# Altium schematic sheet Quadcopter.SchDoc
size A; PageSetup: Record=PageOptions|CenterHorizontal=True|CenterVertical=True|PrintScale=1.00|XCorrection=1.00|YCorrection=1.00|PrintKind=1|BorderSize=5000000|LeftOffset=0|BottomOffset=0|Orientation=2|PaperLength=1000|PaperWidth=1000|Scale=100|PaperSource=7|PrintQuality=-3|MediaType=1|DitherType=10|PrintScaleMode=1|PaperKind=A3|PaperIndex=8
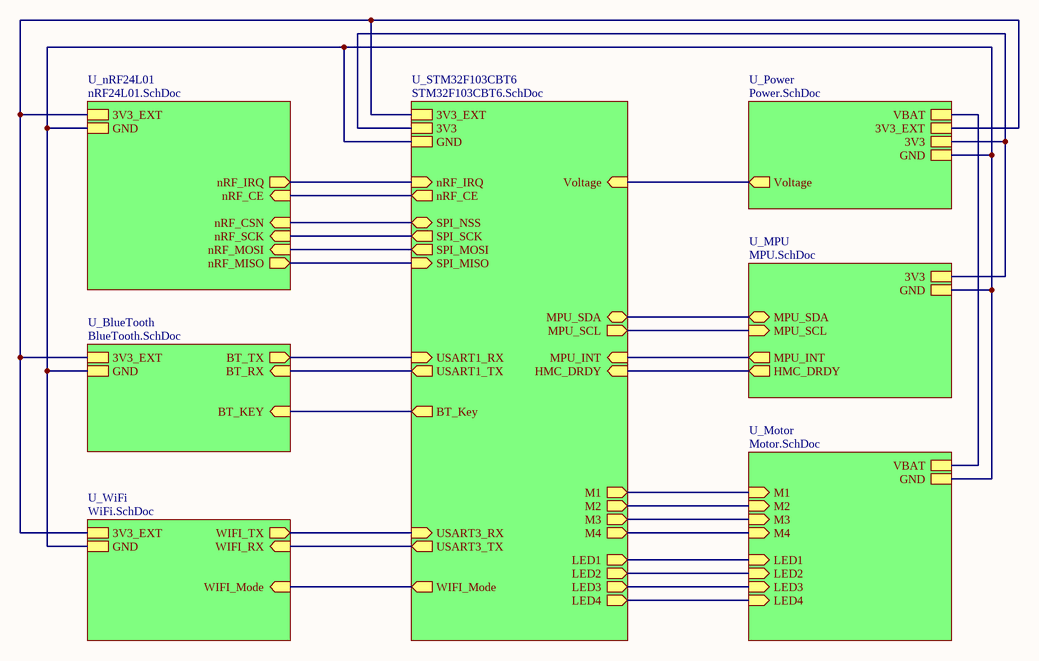
[diagram p0: Quadcopter.SchDoc]

## Sub-sheets
U_BlueTooth = BlueTooth.SchDoc: 3V3_EXT, GND, BT_RX (in), BT_TX (out), BT_KEY (in)
U_Motor = Motor.SchDoc: M1 (in), M2 (in), M3 (in), M4 (in), GND, VBAT, LED1 (in), LED2 (in), LED3 (in), LED4 (in)
U_MPU = MPU.SchDoc: MPU_INT (out), 3V3, GND, MPU_SDA (bidir), MPU_SCL (in), HMC_DRDY (out)
U_nRF24L01 = nRF24L01.SchDoc: 3V3_EXT, GND, nRF_CSN (in), nRF_CE (in), nRF_SCK (in), nRF_MISO (out), nRF_MOSI (in), nRF_IRQ (out)
U_Power = Power.SchDoc: 3V3_EXT, GND, 3V3, VBAT, Voltage (out)
U_STM32F103CBT6 = STM32F103CBT6.SchDoc: Voltage (in), MPU_SCL (out), MPU_SDA (bidir), 3V3_EXT, GND, 3V3, M1 (out), M2 (out), M3 (out), M4 (out), LED1 (out), LED2 (out), LED3 (out), LED4 (out), WIFI_Mode (out), SPI_MISO (in), SPI_MOSI (out), SPI_SCK (out), SPI_NSS (bidir), MPU_INT (in), HMC_DRDY (in), USART1_TX (out), USART1_RX (in), USART3_TX (out), USART3_RX (in), BT_Key (out), nRF_IRQ (in), nRF_CE (out)
U_WiFi = WiFi.SchDoc: WIFI_Mode (in), WIFI_RX (in), WIFI_TX (out), 3V3_EXT, GND

## Nets
(unnamed): sheet U_STM32F103CBT6/Voltage, sheet U_Power/Voltage
(unnamed): sheet U_STM32F103CBT6/MPU_SCL, sheet U_MPU/MPU_SCL
(unnamed): sheet U_STM32F103CBT6/MPU_SDA, sheet U_MPU/MPU_SDA
(unnamed): sheet U_STM32F103CBT6/3V3_EXT, sheet U_Power/3V3_EXT, sheet U_nRF24L01/3V3_EXT, sheet U_BlueTooth/3V3_EXT, sheet U_WiFi/3V3_EXT
(unnamed): sheet U_STM32F103CBT6/GND, sheet U_MPU/GND, sheet U_Motor/GND, sheet U_Power/GND, sheet U_nRF24L01/GND, sheet U_BlueTooth/GND, sheet U_WiFi/GND
(unnamed): sheet U_STM32F103CBT6/3V3, sheet U_MPU/3V3, sheet U_Power/3V3
(unnamed): sheet U_STM32F103CBT6/M1, sheet U_Motor/M1
(unnamed): sheet U_STM32F103CBT6/M2, sheet U_Motor/M2
(unnamed): sheet U_STM32F103CBT6/M3, sheet U_Motor/M3
(unnamed): sheet U_STM32F103CBT6/M4, sheet U_Motor/M4
(unnamed): sheet U_STM32F103CBT6/LED1, sheet U_Motor/LED1
(unnamed): sheet U_STM32F103CBT6/LED2, sheet U_Motor/LED2
(unnamed): sheet U_STM32F103CBT6/LED3, sheet U_Motor/LED3
(unnamed): sheet U_STM32F103CBT6/LED4, sheet U_Motor/LED4
(unnamed): sheet U_STM32F103CBT6/WIFI_Mode, sheet U_WiFi/WIFI_Mode
(unnamed): sheet U_STM32F103CBT6/SPI_MISO, sheet U_nRF24L01/nRF_MISO
(unnamed): sheet U_STM32F103CBT6/SPI_MOSI, sheet U_nRF24L01/nRF_MOSI
(unnamed): sheet U_STM32F103CBT6/SPI_SCK, sheet U_nRF24L01/nRF_SCK
(unnamed): sheet U_STM32F103CBT6/SPI_NSS, sheet U_nRF24L01/nRF_CSN
(unnamed): sheet U_STM32F103CBT6/MPU_INT, sheet U_MPU/MPU_INT
(unnamed): sheet U_STM32F103CBT6/HMC_DRDY, sheet U_MPU/HMC_DRDY
(unnamed): sheet U_STM32F103CBT6/USART1_TX, sheet U_BlueTooth/BT_RX
(unnamed): sheet U_STM32F103CBT6/USART1_RX, sheet U_BlueTooth/BT_TX
(unnamed): sheet U_STM32F103CBT6/USART3_TX, sheet U_WiFi/WIFI_RX
(unnamed): sheet U_STM32F103CBT6/USART3_RX, sheet U_WiFi/WIFI_TX
(unnamed): sheet U_STM32F103CBT6/BT_Key, sheet U_BlueTooth/BT_KEY
(unnamed): sheet U_STM32F103CBT6/nRF_IRQ, sheet U_nRF24L01/nRF_IRQ
(unnamed): sheet U_STM32F103CBT6/nRF_CE, sheet U_nRF24L01/nRF_CE
(unnamed): sheet U_Motor/VBAT, sheet U_Power/VBAT